# Altium schematic sheet Top Level.SchDoc
size 431 x 279 mm; Author: Miguel Manguerra; Revision: A; SheetNumber: 1; SheetTotal: 6
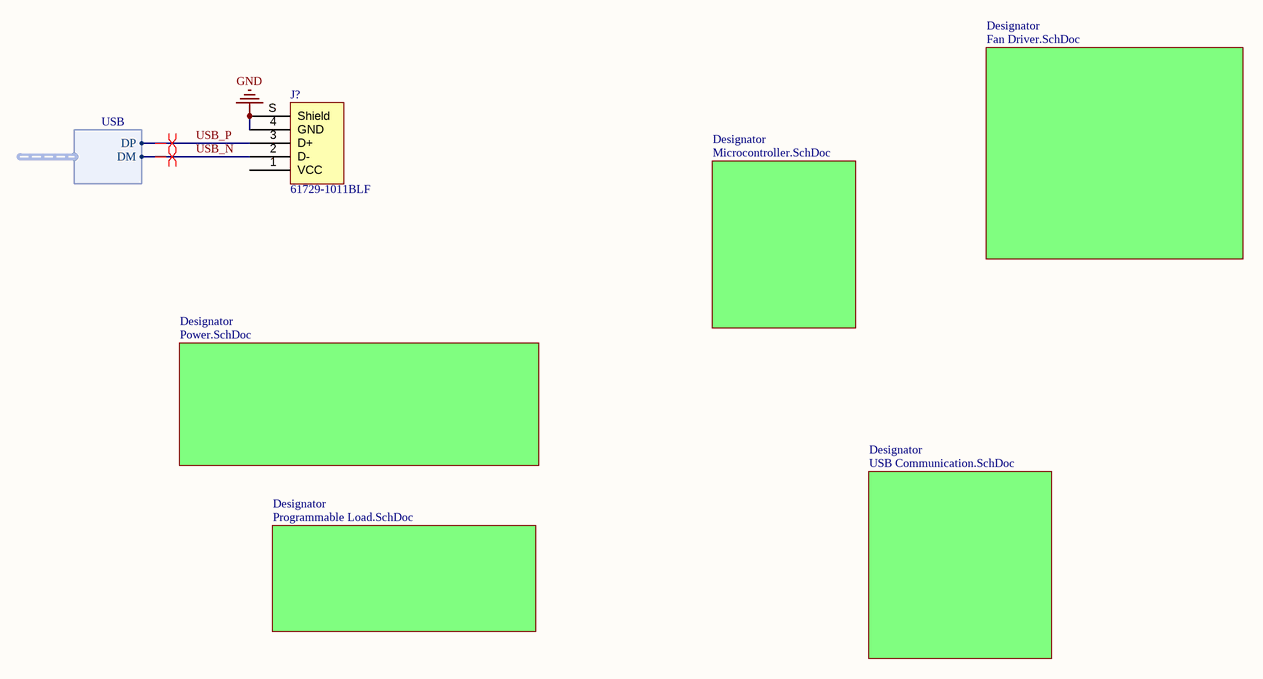
[diagram p0: Top Level.SchDoc]

## Parts
J?  61729-1011BLF  [FCI USB 61729-1011BLF]

## Sub-sheets
Designator = Microcontroller.SchDoc: no entries
Designator = Programmable Load.SchDoc: no entries
Designator = USB Communication.SchDoc: no entries
Designator = Power.SchDoc: no entries
Designator = Fan Driver.SchDoc: no entries

## Harnesses
USB: DM, DP

## Nets
GND: J?.4(GND) J?.S(Shield)
USB_N: J?.2(D-) ; harness USB.DM
USB_P: J?.3(D+) ; harness USB.DP

Not connected (* = marked no-connect by the designer): J? 1(VCC)

## Layout directives
differential pair: USB_N, USB_P

## Notes on the sheet
- DWG. NO.
- REV.
- SHT.
- THIS DOCUMENT AND THE DATA DISCLOSED HEREIN OR HEREWITH IS THE PROPERTY OF ALTIUM LIMITED AND MAY BE FREELY DISTRIBUTED IN WHOLE. NO RIGHTS ARE RESERVED OR EXPRESS OR IMPLIED WARANTEE GIVEN.
- REVISION
- DESCRIPTION
- DATE
- APPROVED
- ENG:
- APPROVALS
- PROJECT
- DSN:
- CHK:
- REFERENCE DOCUMENTS
- PROJECT REVISION:
- TITLE
- DOCUMENT REVISION:
- DESIGN ITEM:
- BOM:
- FAB DWG:
- PCB DWG:
- ASSY DWG:
- SCALE:
- SIZE
- B
- CAGE CODE
- FILE NAME
- DWG NO.
- SHEET
- OF
- REV

## Library data of the parts
J? = 61729-1011BLF: CONN RCPT USB2.0 TYPEB 4POS R/A; Manufacturer: Amphenol ICC (FCI); Connector Type: USB - B; Current Rating (Amps): 1A; Gender: Receptacle; Mating Cycles: 1500; Number of Contacts: 4; Number of Ports: 1; Shielding: Shielded; Part Number: 61729-1011BLF; ComponentLink1Description: Datasheet; ComponentLink1URL: http://www.amphenol-icc.com/media/wysiwyg/files/drawing/61729.pdf; ComponentLink2Description: DigiKey Link; ComponentLink2URL: //digikey.com/product-detail/en/amphenol-icc-fci/61729-1011BLF/609-3657-ND/1490763; Features: Board Lock; LastUpdated: 2019-12-09 8:52:52 PM; Lifecycle Status: 0; Minimum Order: 1; Mounting Feature: Horizontal; Mounting Type: Through Hole, Right Angle; Operating Temperature: -55°C ~ 85°C; Packaging: Tube; Part Status: Active; Price: 0.99; Series: 61729; Specifications: USB 2.0; Supplier 1: DigiKey; Supplier Part Number 1: 609-3657-ND; Termination: Solder